# EAGLE design picostepseq_mk2_16 (EAGLE 9.6.2)
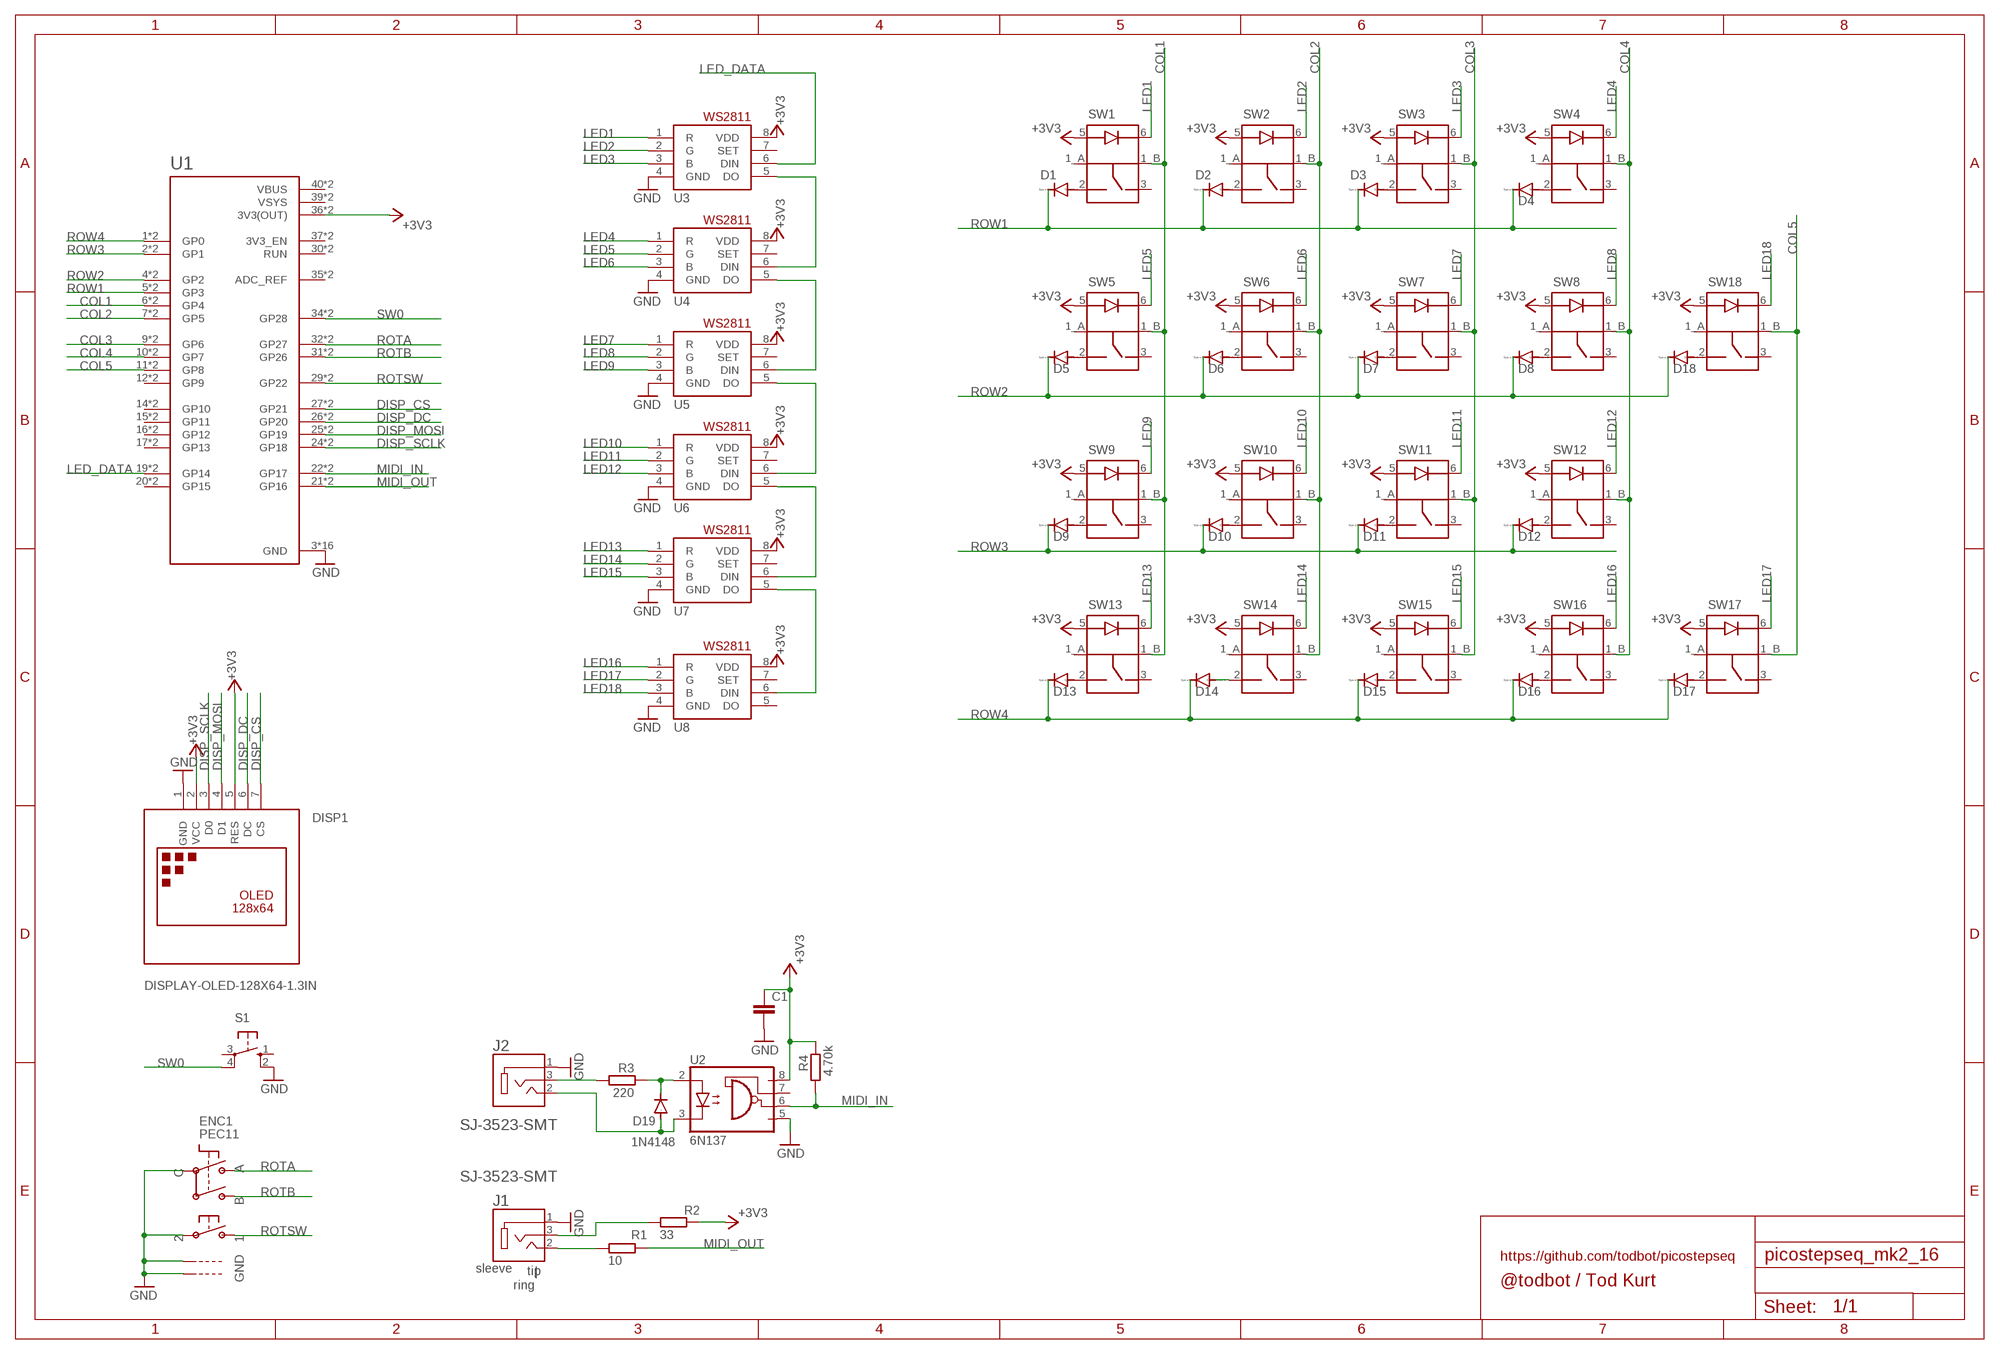
[diagram p0: schematic, sheet 1]

## Parts
C1  C-EU025-025X050  [C025-025X050]
D1  1N4148  1N4148DO35-7  [DO35-7]
D2  1N4148  1N4148DO35-7  [DO35-7]
D3  1N4148  1N4148DO35-7  [DO35-7]
D4  1N4148  1N4148DO35-7  [DO35-7]
D5  1N4148  1N4148DO35-7  [DO35-7]
D6  1N4148  1N4148DO35-7  [DO35-7]
D7  1N4148  1N4148DO35-7  [DO35-7]
D8  1N4148  1N4148DO35-7  [DO35-7]
D9  1N4148  1N4148DO35-7  [DO35-7]
D10  1N4148  1N4148DO35-7  [DO35-7]
D11  1N4148  1N4148DO35-7  [DO35-7]
D12  1N4148  1N4148DO35-7  [DO35-7]
D13  1N4148  1N4148DO35-7  [DO35-7]
D14  1N4148  1N4148DO35-7  [DO35-7]
D15  1N4148  1N4148DO35-7  [DO35-7]
D16  1N4148  1N4148DO35-7  [DO35-7]
D17  1N4148  1N4148DO35-7  [DO35-7]
D18  1N4148  1N4148DO35-7  [DO35-7]
D19  1N4148  1N4148DO35-7  [DO35-7]
DISP1  DISPLAY-OLED-128X64-1.3IN  [DISPLAY-OLED-128X64-1.3IN]
ENC1  PEC11  ENCODER_PLUS_SWITCH_BOURNS_PEC11  [PEC11+SWITCH]
J1  SJ-3523-SMT  [CUI_SJ-3523-SMT]
J2  SJ-3523-SMT  [CUI_SJ-3523-SMT]
R1  10  R-EU_0204/7  [0204/7]
R2  33  R-EU_0204/7  [0204/7]
R3  220  R-EU_0204/7  [0204/7]
R4  4.70k  R-EU_0204/7  [0204/7]
S1  10-XX  [B3F-10XX]
SW1  LED_SWITCHSTEP  [LED_SWITCH_STEP]
SW2  LED_SWITCHSTEP  [LED_SWITCH_STEP]
SW3  LED_SWITCHSTEP  [LED_SWITCH_STEP]
SW4  LED_SWITCHSTEP  [LED_SWITCH_STEP]
SW5  LED_SWITCHSTEP  [LED_SWITCH_STEP]
SW6  LED_SWITCHSTEP  [LED_SWITCH_STEP]
SW7  LED_SWITCHSTEP  [LED_SWITCH_STEP]
SW8  LED_SWITCHSTEP  [LED_SWITCH_STEP]
SW9  LED_SWITCHSTEP  [LED_SWITCH_STEP]
SW10  LED_SWITCHSTEP  [LED_SWITCH_STEP]
SW11  LED_SWITCHSTEP  [LED_SWITCH_STEP]
SW12  LED_SWITCHSTEP  [LED_SWITCH_STEP]
SW13  LED_SWITCHSTEP  [LED_SWITCH_STEP]
SW14  LED_SWITCHSTEP  [LED_SWITCH_STEP]
SW15  LED_SWITCHSTEP  [LED_SWITCH_STEP]
SW16  LED_SWITCHSTEP  [LED_SWITCH_STEP]
SW17  LED_SWITCHSTEP  [LED_SWITCH_STEP]
SW18  LED_SWITCHSTEP  [LED_SWITCH_STEP]
U1  RASPBERRY_PICO-NO_DEBUG  [PICO-PKG-NO_DEBUG]
U2  6N137  [DIL08]
U3  WS2811-SOP8  [SO08-SKINNYPADS]
U4  WS2811-SOP8  [SO08-SKINNYPADS]
U5  WS2811-SOP8  [SO08-SKINNYPADS]
U6  WS2811-SOP8  [SO08-SKINNYPADS]
U7  WS2811-SOP8  [SO08-SKINNYPADS]
U8  WS2811-SOP8  [SO08-SKINNYPADS]

## Nets
+3V3: C1.1 DISP1.2(VCC) DISP1.5(RES) R2.2 R4.1 SW1.5 SW2.5 SW3.5 SW4.5 SW5.5 SW6.5 SW7.5 SW8.5 SW9.5 SW10.5 SW11.5 SW12.5 SW13.5 SW14.5 SW15.5 SW16.5 SW17.5 SW18.5 U1.36(3V3(OUT)) U1.P$36(3V3(OUT)) U2.8(VCC) U3.8(VDD) U4.8(VDD) U5.8(VDD) U6.8(VDD) U7.8(VDD) U8.8(VDD)
COL1: SW1.1_B SW5.1_B SW9.1_B SW13.1_B U1.6(GP4) U1.P$6(GP4)
COL2: SW2.1_B SW6.1_B SW10.1_B SW14.1_B U1.7(GP5) U1.P$7(GP5)
COL3: SW3.1_B SW7.1_B SW11.1_B SW15.1_B U1.9(GP6) U1.P$9(GP6)
COL4: SW4.1_B SW8.1_B SW12.1_B SW16.1_B U1.10(GP7) U1.P$10(GP7)
COL5: SW17.1_B SW18.1_B U1.11(GP8) U1.P$11(GP8)
DISP_CS: DISP1.7(CS) U1.27(GP21) U1.P$27(GP21)
DISP_DC: DISP1.6(DC) U1.26(GP20) U1.P$26(GP20)
DISP_MOSI: DISP1.4(D1) U1.25(GP19) U1.P$25(GP19)
DISP_SCLK: DISP1.3(D0) U1.24(GP18) U1.P$24(GP18)
GND: C1.2 DISP1.1(GND) ENC1.P$2 ENC1.P$C ENC1.P$GND1 ENC1.P$GND2 J1.1 J2.1 S1.2(S1) U1.3(GND) U1.8(GND) U1.13(GND) U1.18(GND) U1.23(GND) U1.28(GND) U1.33(GND) U1.38(GND) U1.P$3(GND) U1.P$8(GND) U1.P$13(GND) U1.P$18(GND) U1.P$23(GND) U1.P$28(GND) U1.P$33(GND) U1.P$38(GND) U2.5(GND) U3.4(GND) U4.4(GND) U5.4(GND) U6.4(GND) U7.4(GND) U8.4(GND)
LED1: SW1.6 U3.1(R)
LED2: SW2.6 U3.2(G)
LED3: SW3.6 U3.3(B)
LED4: SW4.6 U4.1(R)
LED5: SW5.6 U4.2(G)
LED6: SW6.6 U4.3(B)
LED7: SW7.6 U5.1(R)
LED8: SW8.6 U5.2(G)
LED9: SW9.6 U5.3(B)
LED10: SW10.6 U6.1(R)
LED11: SW11.6 U6.2(G)
LED12: SW12.6 U6.3(B)
LED13: SW13.6 U7.1(R)
LED14: SW14.6 U7.2(G)
LED15: SW15.6 U7.3(B)
LED16: SW16.6 U8.1(R)
LED17: SW17.6 U8.2(G)
LED18: SW18.6 U8.3(B)
LED_DATA: U1.19(GP14) U1.P$19(GP14) U3.6(DIN)
MIDI_IN: R4.2 U1.22(GP17) U1.P$22(GP17) U2.6(VO)
MIDI_OUT: R1.2 U1.21(GP16) U1.P$21(GP16)
N$1: J1.2 R1.1
N$2: D19.C R3.1 U2.2(A)
N$3: D1.A SW1.2
N$4: D19.A J2.2 U2.3(C)
N$5: D2.A SW2.2
N$6: D3.A SW3.2
N$7: D4.A SW4.2
N$8: D5.A SW5.2
N$9: D9.A SW9.2
N$10: D10.A SW10.2
N$11: D11.A SW11.2
N$12: D12.A SW12.2
N$13: J1.3 R2.1
N$14: J2.3 R3.2
N$15: D13.A SW13.2
N$16: D14.A SW14.2
N$17: D15.A SW15.2
N$18: D16.A SW16.2
N$19: D17.A SW17.2
N$20: D6.A SW6.2
N$21: D18.A SW18.2
N$22: U3.5(DO) U4.6(DIN)
N$23: U4.5(DO) U5.6(DIN)
N$25: U5.5(DO) U6.6(DIN)
N$26: U6.5(DO) U7.6(DIN)
N$27: U7.5(DO) U8.6(DIN)
N$29: D7.A SW7.2
N$30: D8.A SW8.2
ROTA: ENC1.P$A U1.32(GP27) U1.P$32(GP27)
ROTB: ENC1.P$B U1.31(GP26) U1.P$31(GP26)
ROTSW: ENC1.P$1 U1.29(GP22) U1.P$29(GP22)
ROW1: D1.C D2.C D3.C D4.C U1.5(GP3) U1.P$5(GP3)
ROW2: D5.C D6.C D7.C D8.C D18.C U1.4(GP2) U1.P$4(GP2)
ROW3: D9.C D10.C D11.C D12.C U1.2(GP1) U1.P$2(GP1)
ROW4: D13.C D14.C D15.C D16.C D17.C U1.1(GP0) U1.P$1(GP0)
SW0: S1.4(P1) U1.34(GP28) U1.P$34(GP28)
Unconnected: S1.1(S) S1.3(P) SW1.1_A SW1.3 SW2.1_A SW2.3 SW3.1_A SW3.3 SW4.1_A SW4.3 SW5.1_A SW5.3 SW6.1_A SW6.3 SW7.1_A SW7.3 SW8.1_A SW8.3 SW9.1_A SW9.3 SW10.1_A SW10.3 SW11.1_A SW11.3 SW12.1_A SW12.3 SW13.1_A SW13.3 SW14.1_A SW14.3 SW15.1_A SW15.3 SW16.1_A SW16.3 SW17.1_A SW17.3 SW18.1_A SW18.3 U1.12(GP9) U1.14(GP10) U1.15(GP11) U1.16(GP12) U1.17(GP13) U1.20(GP15) U1.30(RUN) U1.35(ADC_REF) U1.37(3V3_EN) U1.P$12(GP9) U1.P$14(GP10) U1.P$15(GP11) U1.P$16(GP12) U1.P$17(GP13) U1.P$20(GP15) U1.P$30(RUN) U1.P$35(ADC_REF) U1.P$37(3V3_EN) U2.7(VE) U3.7(SET) U4.7(SET) U5.7(SET) U6.7(SET) U7.7(SET) U8.5(DO) U8.7(SET)

## Notes on the sheet
- https://github.com/todbot/picostepseq
- sleeve | tip
- @todbot / Tod Kurt
- |
  ring

## Power pins joined to a net without a drawn wire
VBUS: U1.40(VBUS) U1.P$40(VBUS)
VSYS: U1.39(VSYS) U1.P$39(VSYS)

## Library data of the parts
C1 = rcl:C-EU: CAPACITOR, European symbol; SPICEPREFIX: C
D1-D19 = diode:1N4148: DIODE high speed (Philips)
DISP1 = todstuff:DISPLAY-OLED-128X64: 128x64 Dot Matrix OLED Module based on SSD1306 chip Variant with SPI interface More details available here: http://www.instructables.com/id/How-to-use-OLED-display-arduino-module/ SSD1306 datasheet: https://cdn-shop.adafruit.com/datasheets/SSD1306.pdf Click here to find device on ebay.com <http://www.ebay.com/sch/oled+display+128x64> Note: There are two variants: I2C and SPI. Search for the proper version.
ENC1 = adafruit_electromech:ENCODER_PLUS_SWITCH: Rotary Encoder with Built-In Switch PEC11 - 24 Step, PEC11-4215F-S24 - http://www.adafruit.com/products/377
J1 J2 = SJ-3523-SMT:SJ-3523-SMT: Audio Jack Connector 3.5 mm Low Profile Surface Mount Stereo Jack, 3 Pin Right-Angle; CUI_PURCHASE_URL: https://www.cuidevices.com/product/interconnect/connectors/audio-connectors/jacks/sj-352x-smt-series?utm_source=snapeda.com&utm_medium=referral&utm_campaign=snapedaBOM; DESCRIPTION: 3.5 mm, Stereo, Right Angle, Surface Mount (SMT), 3 Conductors, 0~1 Internal Switches, Audio Jack Connector; DIGI-KEY_PART_NUMBER: CP-3523SJCT-ND; MF: CUI Devices; MP: SJ-3523-SMT-TR; PACKAGE: None; PURCHASE-URL: https://pricing.snapeda.com/search/part/SJ-3523-SMT-TR/?ref=eda
R1-R4 = rcl:R-EU_: RESISTOR, European symbol; SPICEPREFIX: R
S1 = switch-omron:10-XX: OMRON SWITCH; MPN: B3F-1000; OC_FARNELL: 176432; OC_NEWARK: 36M3542
SW1-SW18 = todstuff:LED_SWITCH: Step switch with LED, like on old drum machines https://www.adafruit.com/product/5519
U1 = RpiPico:RASPBERRY_PICO-NO_DEBUG
U2 = optocoupler:6N137: MOTOROLA OPTO COUPLER; MPN: 6N137; OC_FARNELL: 1328376; OC_NEWARK: 52M1895
U3-U8 = adafruit:WS2811

## Board
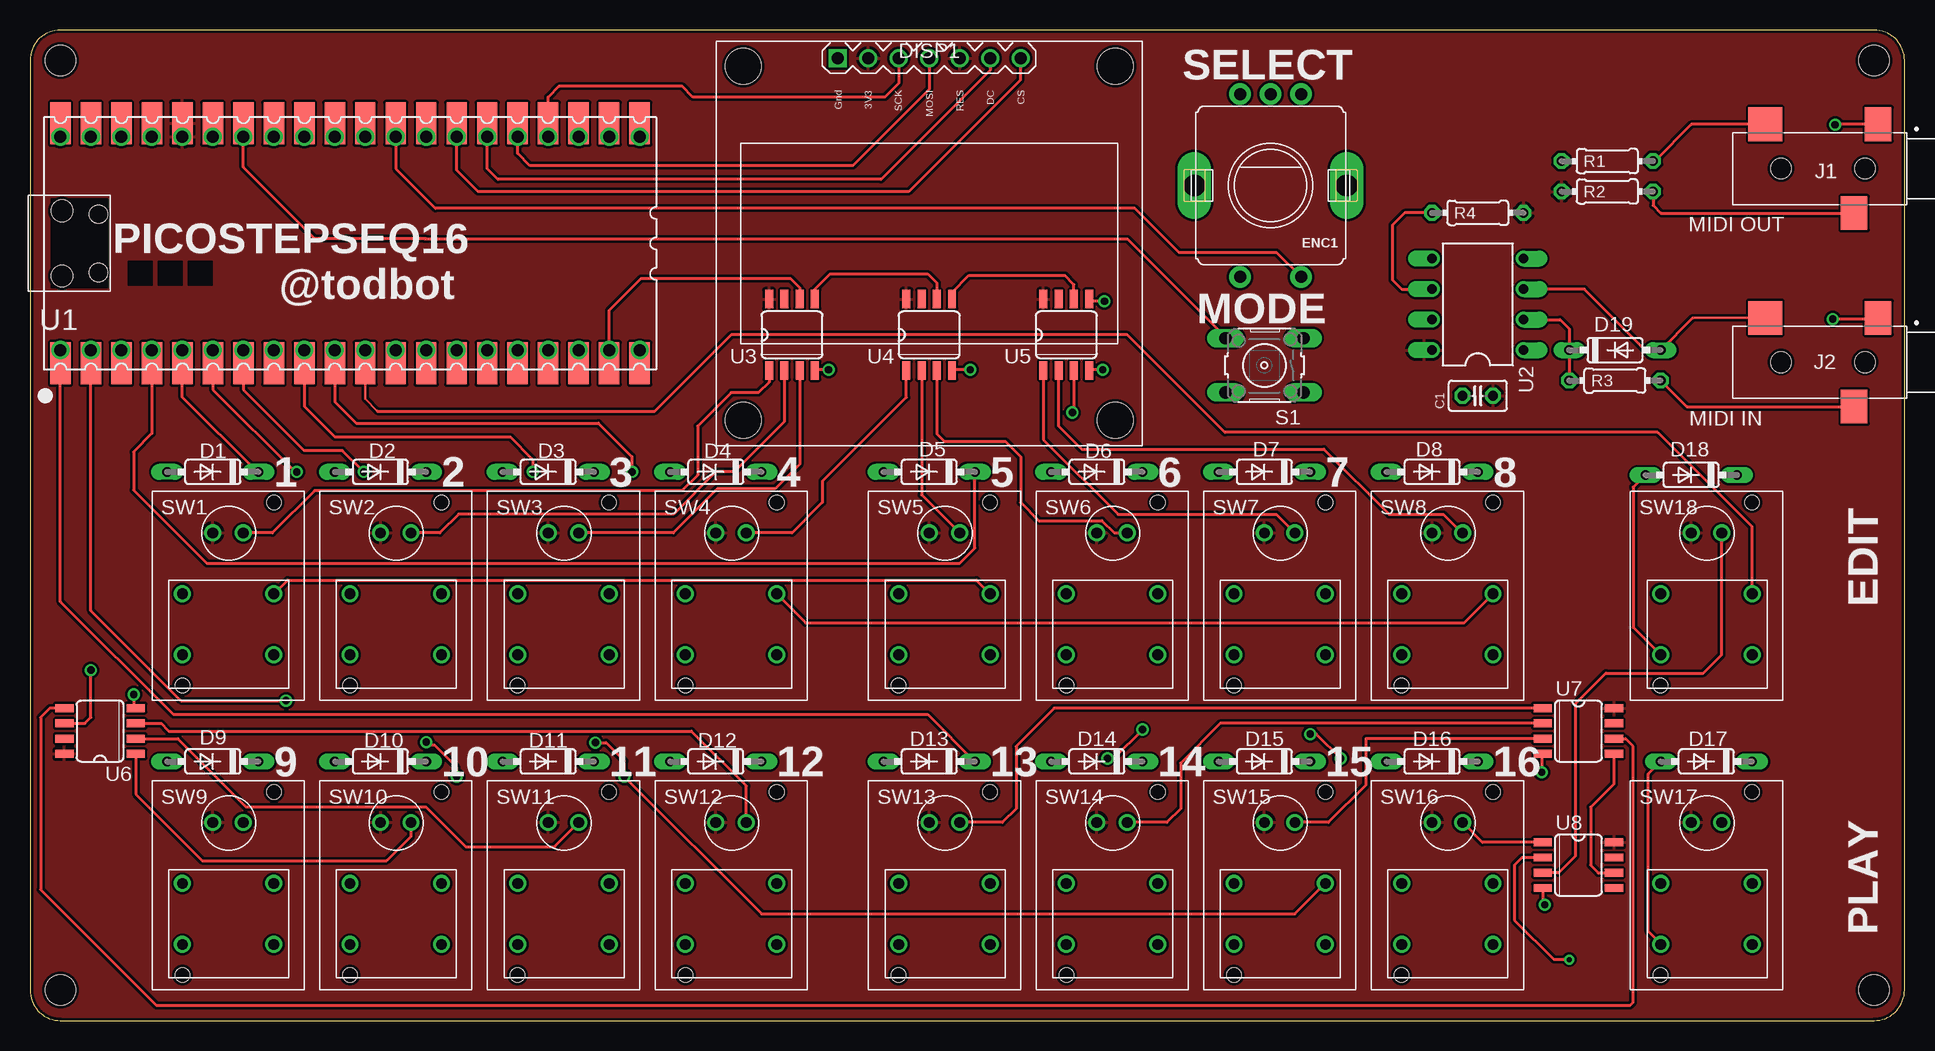
[diagram p1: board, top side]
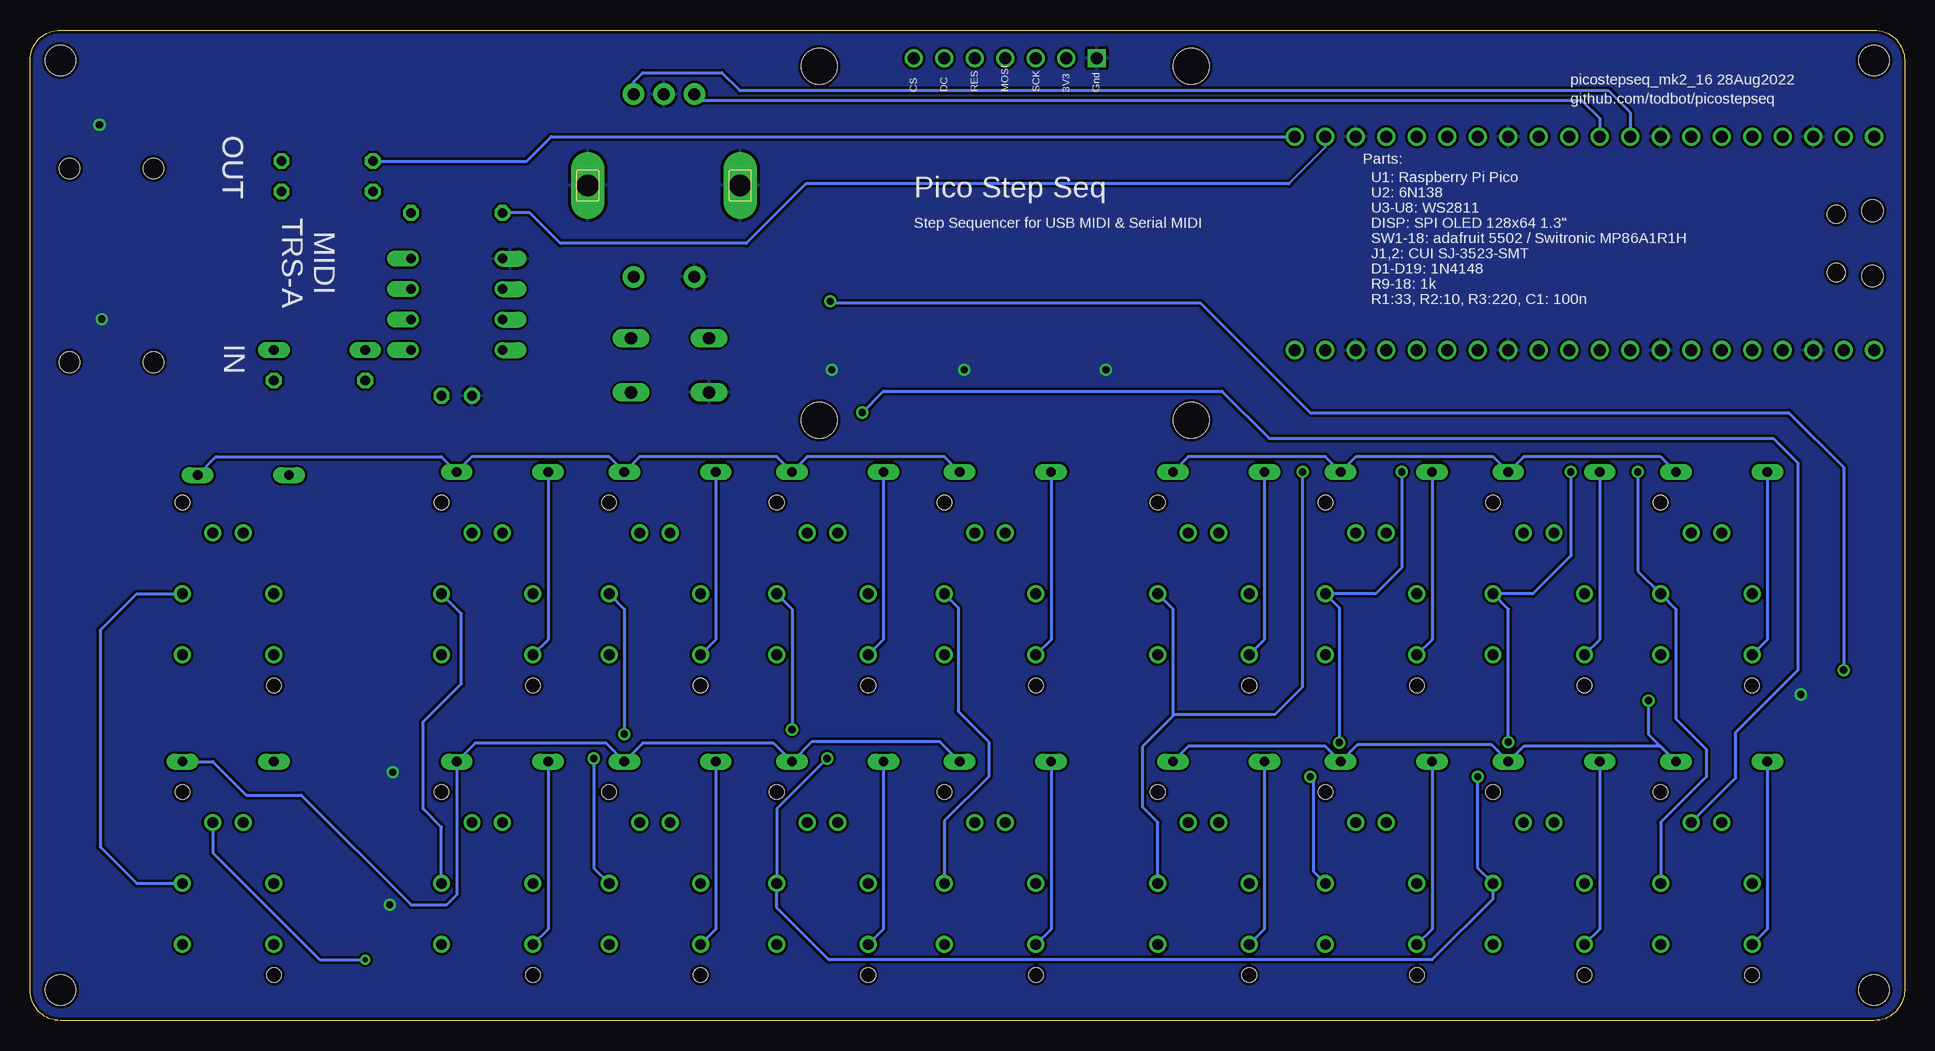
[diagram p2: board, bottom side, seen from below]

Size 156.21 x 82.55 mm. Coordinates in mm from the lower left corner, seen from the top.
Outline: 0,80.01 0,2.54 arc90 2.54,0 153.67,0 arc90 156.21,2.54 156.21,80.01 arc90 153.67,82.55 2.54,82.55 arc90 0,80.01
Copper layers (1*16): Top 0.035mm / dielectric 1.5mm / Bottom 0.035mm
Design rules "adafruit-rules-20180530": minimum track width 8mil, minimum drill 16mil, track to track 8mil, track to pad 8mil, pad to pad 8mil, via to via 8mil, smd to smd 8mil, copper to edge 10mil, drill to drill 8mil, minimum pad ring 10mil, minimum via ring 8mil, stop-mask expansion 4mil, vias tented up to drill 20mil, thermal gap 10mil
Holes 2.54 mm at 2.54,2.54 153.67,2.54 153.67,80.01 2.54,80.01

### Footprints (pad centres in the part's own frame; a part is rotated, then mirrored left to right if it is on the bottom)
C025-025X050 = drill 0.813 octagon: 1 -1.27,0; 2 1.27,0
DO35-7 = drill 0.813 long: A 3.81,0; C -3.81,0
DISPLAY-OLED-128X64-1.3IN = drill 1 square: 1 -7.62,15.43 | drill 1: 2 -5.08,15.43; 3 -2.54,15.43; 4 0,15.43; 5 2.54,15.43; 6 5.08,15.43; 7 7.62,15.43 | hole 3: -15.5,14.75; 15.5,14.75; 15.5,-14.75; -15.5,-14.75
PEC11+SWITCH = drill 1 pad 1.8: P$1 -2.54,7.62; P$2 2.54,7.62; P$A -2.54,-7.62; P$B 2.54,-7.62; P$C 0,-7.62 | drill 1.8 pad 2.8 long: P$GND1 -6.35,0; P$GND2 6.35,0
CUI_SJ-3523-SMT = smd 2.2 x 2.8: 1 -1.1,-3.7; 3 0.9,3.7 | smd 2.8 x 2.8: 2 8.3,-3.7 | hole 1.7: 0,0; 7,0
0204/7 = drill 0.813 octagon: 1 -3.81,0; 2 3.81,0
B3F-10XX = drill 1.016 long: 1 -3.251,2.261; 2 3.251,2.261; 3 -3.251,-2.261; 4 3.251,-2.261
LED_SWITCH_STEP = drill 0.9: 1_A -3.81,0; 1_B 3.81,0; 2 -3.81,-5.08; 3 3.81,-5.08; 5 -1.27,5.08; 6 1.27,5.08 | hole 1.2: -3.81,-7.62; 3.81,7.62
PICO-PKG-NO_DEBUG = drill 1: 1 -7.62,25.4; 2 -7.62,22.86; 3 -7.62,20.32; 4 -7.62,17.78; 5 -7.62,15.24; 6 -7.62,12.7; 7 -7.62,10.16; 8 -7.62,7.62; 9 -7.62,5.08; 10 -7.62,2.54; 11 -7.62,0; 12 -7.62,-2.54; 13 -7.62,-5.08; 14 -7.62,-7.62; 15 -7.62,-10.16; 16 -7.62,-12.7; 17 -7.62,-15.24; 18 -7.62,-17.78; 19 -7.62,-20.32; 20 -7.62,-22.86; 21 10.16,-22.86; 22 10.16,-20.32; 23 10.16,-17.78; 24 10.16,-15.24; 25 10.16,-12.7; 26 10.16,-10.16; 27 10.16,-7.62; 28 10.16,-5.08; 29 10.16,-2.54; 30 10.16,0; 31 10.16,2.54; 32 10.16,5.08; 33 10.16,7.62; 34 10.16,10.16; 35 10.16,12.7; 36 10.16,15.24; 37 10.16,17.78; 38 10.16,20.32; 39 10.16,22.86; 40 10.16,25.4 | smd 3.5 x 1.7: P$1 -8.73,25.4; P$2 -8.73,22.86; P$3 -8.73,20.32; P$4 -8.73,17.78; P$5 -8.73,15.24; P$6 -8.73,12.7; P$7 -8.73,10.16; P$8 -8.73,7.62; P$9 -8.73,5.08; P$10 -8.73,2.54; P$11 -8.73,0; P$12 -8.73,-2.54; P$13 -8.73,-5.08; P$14 -8.73,-7.62; P$15 -8.73,-10.16; P$16 -8.73,-12.7; P$17 -8.73,-15.24; P$18 -8.73,-17.78; P$19 -8.73,-20.32; P$20 -8.73,-22.86; P$21 11.27,-22.86; P$22 11.27,-20.32; P$23 11.27,-17.78; P$24 11.27,-15.24; P$25 11.27,-12.7; P$26 11.27,-10.16; P$27 11.27,-7.62; P$28 11.27,-5.08; P$29 11.27,-2.54; P$30 11.27,0; P$31 11.27,2.54; P$32 11.27,5.08; P$33 11.27,7.62; P$34 11.27,10.16; P$35 11.27,12.7; P$36 11.27,15.24; P$37 11.27,17.78; P$38 11.27,20.32; P$39 11.27,22.86; P$40 11.27,25.4 | hole 1.8: -1.455,25.27; 3.995,25.27 | hole 1.5: -1.155,22.24; 3.695,22.24
DIL08 = drill 0.813 offset: 1 -3.81,-3.81; 2 -1.27,-3.81; 3 1.27,-3.81; 4 3.81,-3.81; 5 3.81,3.81; 6 1.27,3.81; 7 -1.27,3.81; 8 -3.81,3.81
SO08-SKINNYPADS = smd 0.66 x 1.524: 1 -1.905,-2.973; 2 -0.635,-2.973; 3 0.635,-2.973; 4 1.905,-2.973; 5 1.905,2.973; 6 0.635,2.973; 7 -0.635,2.973; 8 -1.905,2.973

### Placement (x,y rotation side)
C1  120.65,52.07 180 top
D1  15.24,45.72 180 top
D2  29.21,45.72 180 top
D3  43.18,45.72 180 top
D4  57.15,45.72 180 top
D5  74.93,45.72 180 top
D6  88.9,45.72 180 top
D7  102.87,45.72 180 top
D8  116.84,45.72 180 top
D9  15.24,21.59 180 top
D10  29.21,21.59 180 top
D11  43.18,21.59 180 top
D12  57.15,21.59 180 top
D13  74.93,21.59 180 top
D14  88.9,21.59 180 top
D15  102.87,21.59 180 top
D16  116.84,21.59 180 top
D17  139.7,21.59 180 top
D18  138.43,45.47 180 top
D19  132.08,55.88 0 top
DISP1  74.93,64.77 0 top
ENC1  103.38,69.6 180 top
J1  152.91,70.99 180 top
J2  152.91,54.86 180 top
R1  131.44,71.63 180 top
R2  131.44,69.09 180 top
R3  132.08,53.34 0 top
R4  120.65,67.31 180 top
S1  102.87,54.61 180 top
SW1  16.51,35.56 0 top
SW2  30.48,35.56 0 top
SW3  44.45,35.56 0 top
SW4  58.42,35.56 0 top
SW5  76.2,35.56 0 top
SW6  90.17,35.56 0 top
SW7  104.14,35.56 0 top
SW8  118.11,35.56 0 top
SW9  16.51,11.43 0 top
SW10  30.48,11.43 0 top
SW11  44.45,11.43 0 top
SW12  58.42,11.43 0 top
SW13  76.2,11.43 0 top
SW14  90.17,11.43 0 top
SW15  104.14,11.43 0 top
SW16  118.11,11.43 0 top
SW17  139.7,11.43 0 top
SW18  139.7,35.56 0 top
U1  27.94,63.5 90 top
U2  120.65,59.69 90 top
U3  63.5,57.15 0 top
U4  74.93,57.15 0 top
U5  86.36,57.15 0 top
U6  5.84,24.13 90 top
U7  129.03,24.13 270 top
U8  129.03,12.95 270 top

### Tracks (layer width: path | path; a pad name or v marks a point on that pad's centre or on a via)
+3V3
  pour Top: 156.47,82.63 156.47,0.25 -0.4,0.25 -0.4,82.63
COL1  (via drill 0.6)
  Top 0.254: SW1.1_B 21.46,36.7 78.87,36.7 SW5.1_B | U1.6 U1.P$6 15.24,52.58 22.1,45.72 v22.23,45.72
  Bottom 0.254: SW9.1_B 20.32,16.51 16.51,20.32 16.51,22.61 19.05,25.15 19.05,34.29 SW1.1_B 22.23,37.47 v22.23,45.72 | SW5.1_B 78.87,34.42 78.87,25.78 76.33,23.24 76.33,20.32 80.01,16.64 SW13.1_B
COL2  (via drill 0.6)
  Top 0.254: v35.56,20.32 35.56,21.11 33.71,22.96 33.27,22.96 v33.02,23.21 | v92.71,24.26 90.3,21.84 v89.79,21.84 | U1.7 U1.P$7 17.78,52.58 22.86,47.5 26.04,47.5 v27.81,45.72
  Bottom 0.254: v35.56,20.32 35.56,12.7 SW10.1_B 34.29,10.16 39.39,5.06 89.64,5.06 93.98,9.4 SW14.1_B 93.98,17.65 v89.79,21.84 | v33.02,23.21 33.02,34.29 SW2.1_B 30.99,35.56 27.81,38.73 v27.81,45.72 | SW6.1_B 92.71,34.29 v92.71,24.26
COL3  (via drill 0.6)
  Top 0.254: v47.12,23.17 48.01,23.17 49.53,21.65 v49.53,20.32 60.96,8.89 105.41,8.89 SW15.1_B | v106.68,23.88 107.19,23.88 v109.22,21.84 | U1.9 U1.P$9 22.86,51.18 25.4,48.64 40.01,48.64 41.91,46.74 v41.91,45.72
  Bottom 0.254: v49.53,20.32 49.24,20.03 49.24,12.41 SW11.1_B | v47.12,23.17 47.12,34.42 SW3.1_B 44.07,35.56 41.91,37.72 v41.91,45.72 | SW7.1_B 106.68,34.29 v106.68,23.88 | v109.22,21.84 109.22,12.7 SW15.1_B
COL4  (via drill 0.6)
  Top 0.254: SW4.1_B 64.64,33.15 119.51,33.15 SW8.1_B | U1.10 U1.P$10 25.4,51.56 27.18,49.78 47.37,49.78 50.16,46.99 v50.16,45.72
  Bottom 0.254: SW12.1_B 62.23,16.51 63.5,17.78 63.5,22.86 60.96,25.4 | SW4.1_B 60.96,34.29 60.96,25.4 | SW16.1_B 121.92,16.13 123.44,17.65 123.44,24.89 120.27,28.07 120.27,33.91 SW8.1_B | 60.96,25.4 60.83,25.53 52.45,25.53 50.16,27.81 v50.16,45.72
COL5
  Top 0.203: 28.96,50.8 27.94,51.82 U1.P$11
  Top 0.254: U1.P$11 U1.11 | SW18.1_B 143.51,41.15 135.64,49.02 99.57,49.02 91.44,57.15 58.42,57.15 52.07,50.8 28.96,50.8
  Bottom 0.254: SW18.1_B 147.32,35.56 150.37,32.51 150.37,14.48 147.32,11.43 SW17.1_B
DISP_CS
  Top 0.254: DISP1.7 82.55,78.42 73.22,69.09 37.34,69.09 35.56,70.87 U1.27 U1.P$27
DISP_DC
  Top 0.203: U1.P$26 U1.26
  Top 0.254: DISP1.6 80.01,79.18 70.93,70.1 38.99,70.1 38.1,70.99 U1.P$26
DISP_MOSI
  Top 0.254: DISP1.4 74.93,77.6 68.58,71.25 41.66,71.25 40.64,72.26 U1.25 U1.P$25
DISP_SCLK
  Top 0.203: U1.P$24 U1.24
  Top 0.254: DISP1.3 72.39,78.11 71.25,76.96 55.24,76.96 54.36,77.85 44.07,77.85 43.18,76.96 U1.P$24
GND  (via drill 0.6)
  Top 0.203: U1.P$23 U1.23 | J2.1 153.9,58.46 | 150.45,74.69 v150.42,74.66
  Top 0.254: U1.P$3 U1.3 | U1.P$8 U1.8 | U1.P$13 U1.13 | U1.P$18 U1.18 | U1.P$33 U1.33 | U1.P$38 U1.38 | 153.9,58.46 v150.22,58.46 | J1.1 150.45,74.69 | U1.P$28 U1.28 | U3.4 65.46,54.23 v66.55,54.23 | U4.4 76.89,54.23 v78.36,54.23 | U5.4 88.32,54.23 v89.41,54.23 | U6.4 8.64,26.21 v8.64,27.18 | U7.4 125.98,22.15 v125.98,20.7 | U8.4 126.06,9.83 v126.24,9.65
  pour Bottom: 0,82.36 158.75,82.36 158.75,0.25 0,0.25
LED1
  Top 0.254: SW1.6 20.19,40.64 23.71,44.16 54.32,44.16 55.63,45.47 55.63,49.53 58.42,52.32 60.71,52.32 61.59,53.21 U3.1
LED2
  Top 0.254: SW2.6 34.16,40.64 35.72,42.2 53.63,42.2 57.15,45.72 58.67,45.72 62.87,49.91 U3.2
LED3
  Top 0.254: SW3.6 53.61,40.64 57.29,44.32 62.1,44.32 64.14,46.35 U3.3
LED4
  Top 0.254: SW4.6 63.5,40.64 66.04,43.18 66.04,44.96 73.03,51.94 U4.1
LED5
  Top 0.254: U4.2 74.3,43.81 SW5.6
LED6
  Top 0.254: U4.3 75.56,48.9 76.2,48.26 81.28,48.26 82.55,46.99 82.55,43.18 84.06,41.67 89.33,41.67 90.36,40.64 SW6.6
LED7
  Top 0.254: U5.1 84.45,48.42 90.68,42.19 103.86,42.19 SW7.6
LED8
  Top 0.254: SW8.6 119.32,40.64 117.78,42.18 113.27,42.18 107.82,47.63 87.63,47.63 85.72,49.54 U5.2
LED9  (via drill 0.6)
  Top 0.254: U5.3 87,50.8 v86.87,50.67
  Bottom 0.254: v86.87,50.67 85.09,52.45 56.9,52.45 52.96,48.51 10.92,48.51 8.89,46.48 8.89,29.21 14.1,24 14.1,20.19 SW9.6
LED10
  Top 0.254: U6.1 8.81,18.87 14.35,13.34 29.72,13.34 31.75,15.37 SW10.6
LED11
  Top 0.254: SW11.6 43.69,14.48 36.32,14.48 33.02,17.78 18.03,17.78 12.32,23.5 U6.2
LED12
  Top 0.254: U6.3 10.92,24.77 11.56,24.13 55.12,24.13 59.69,19.56 SW12.6
LED13
  Top 0.254: SW13.6 81.03,16.51 82.17,17.65 82.17,22.86 85.34,26.04 U7.1
LED14
  Top 0.254: U7.2 99.19,24.77 95.89,21.46 95.89,17.65 94.74,16.51 SW14.6
LED15
  Top 0.254: U7.3 111.33,23.5 111.33,19.63 108.2,16.51 SW15.6
LED16
  Top 0.254: U8.1 121.03,14.86 SW16.6
LED17  (via drill 0.41)
  Top 0.254: U8.2 124.33,13.59 123.7,12.95 123.7,8.38 127,5.08 v128.27,5.08
  Bottom 0.254: SW17.6 140.97,13.97 132.08,5.08 v128.27,5.08
LED18
  Top 0.254: U8.3 127.38,12.32 128.78,13.72 128.78,26.42 131.32,28.96 139.45,28.96 140.97,30.48 SW18.6
LED_DATA
  Top 0.254: U1.19 U1.P$19 48.26,59.18 50.93,61.85 63.37,61.85 64.14,61.09 U3.6
MIDI_IN
  Top 0.203: U1.P$22 U1.22
  Top 0.254: R4.2 114.55,67.31 113.54,66.29 113.54,61.72 114.3,60.96 U2.6
  Bottom 0.203: 51.3,69.73 48.26,72.77 U1.22
  Bottom 0.254: R4.2 114.55,67.31 112.01,64.77 96.52,64.77 91.56,69.73 51.3,69.73
MIDI_OUT
  Top 0.203: U1.P$21 U1.21
  Bottom 0.254: U1.21 112.78,73.66 114.81,71.63 R1.2
N$1
  Top 0.254: J1.2 138.45,74.69 135.38,71.63 R1.1
N$2
  Top 0.254: R3.1 D19.C 128.27,57.66 127.51,58.42 U2.2
N$3
  Bottom 0.254: D1.A 11.43,31.75 SW1.2
N$4
  Top 0.203: 138.57,58.56 J2.2
  Top 0.254: 138.57,58.56 D19.A 134.62,55.88 129.54,60.96 U2.3
N$5
  Bottom 0.254: D2.A 25.4,31.75 SW2.2
N$6
  Bottom 0.254: D3.A 39.37,31.75 SW3.2
N$7
  Bottom 0.254: D4.A 53.34,31.75 SW4.2
N$8
  Bottom 0.254: D5.A 71.12,31.75 SW5.2
N$9
  Bottom 0.254: SW9.2 11.43,7.62 D9.A
N$10
  Bottom 0.254: SW10.2 25.4,7.62 D10.A
N$11
  Bottom 0.254: SW11.2 39.37,7.62 D11.A
N$12
  Bottom 0.254: SW12.2 53.34,7.62 D12.A
N$13
  Top 0.254: R2.1 135.25,67.94 135.91,67.29 J1.3
N$14
  Top 0.254: R3.2 138.07,51.16 J2.3
N$15
  Bottom 0.254: D13.A 71.12,7.62 SW13.2
N$16
  Bottom 0.254: D14.A 85.09,7.62 SW14.2
N$17
  Bottom 0.254: D15.A 99.06,7.62 SW15.2
N$18
  Bottom 0.254: D16.A 113.03,7.62 SW16.2
N$19
  Top 0.254: SW17.2 135.89,6.41 134.86,7.45 134.86,20.56 D17.A
N$20
  Bottom 0.254: D6.A 85.09,31.75 SW6.2
N$21
  Top 0.254: D18.A 133.6,44.45 133.6,32.77 SW18.2
N$22
  Top 0.254: U3.5 65.41,60.96 66.67,62.23 74.8,62.23 75.56,61.47 U4.6
N$23
  Top 0.254: U5.6 87,61.34 86.23,62.1 78.23,62.1 76.83,60.71 U4.5
N$25  (via drill 0.6)
  Top 0.254: U6.6 4.57,24.77 5.08,25.27 v5.08,29.21 | U5.5 88.27,59.94 v89.53,59.94
  Bottom 0.254: v89.53,59.94 89.53,59.82 58.67,59.82 49.53,50.67 9.65,50.67 5.08,46.1 v5.08,29.21
N$26
  Top 0.254: U6.5 1.65,26.04 0.89,25.27 0.89,10.92 10.54,1.27 133.35,1.27 133.6,1.52 133.6,22.86 132.97,23.5 U7.6
N$27
  Top 0.254: U8.6 130.68,12.32 130.05,12.95 130.05,17.78 132,19.74 U7.5
N$29
  Bottom 0.254: D7.A 99.06,31.75 SW7.2
N$30
  Bottom 0.254: D8.A 113.03,31.75 SW8.2
ROTA
  Top 0.254: U1.P$32 U1.32
  Bottom 0.254: U1.32 22.86,75.69 24.64,77.47 97.03,77.47 98.55,78.99 105.16,78.99 105.92,78.23 ENC1.P$A
ROTB
  Top 0.254: U1.P$31 U1.31
  Bottom 0.254: ENC1.P$B 100.33,76.71 26.92,76.71 25.4,75.18 U1.31
ROTSW
  Top 0.203: U1.P$29 U1.29
  Top 0.254: ENC1.P$1 103.89,64.01 95.76,64.01 92.08,67.69 33.78,67.69 30.48,70.99 U1.P$29
ROW1
  Top 0.254: D1.C 18.92,45.72 12.7,51.94 U1.P$5 U1.5
  Bottom 0.254: D1.C 20.32,46.99 31.75,46.99 D2.C 34.29,46.99 45.72,46.99 D3.C 48.26,46.99 59.69,46.99 D4.C
ROW2
  Top 0.254: D5.C 78.74,39.37 77.47,38.1 14.73,38.1 8.64,44.2 8.64,47.4 10.16,48.93 U1.P$4 U1.4
  Bottom 0.254: D5.C 80.01,46.99 91.44,46.99 D6.C 93.98,46.99 105.41,46.99 D7.C 107.95,46.99 119.38,46.99 D8.C 121.92,46.99 140.72,46.99 D18.C
ROW3  (via drill 0.6)
  Top 0.254: v21.34,26.67 12.57,26.67 5.08,34.16 U1.P$2 U1.2
  Bottom 0.254: D12.C 59.69,22.86 48.26,22.86 D11.C 45.59,22.99 34.42,22.99 D10.C 31.75,22.86 20.32,22.86 D9.C 21.34,23.88 v21.34,26.67
ROW4
  Top 0.254: D13.C 74.8,25.53 11.94,25.53 2.54,34.92 U1.1 U1.P$1
  Bottom 0.254: D13.C 80.39,23.24 91.06,23.24 D14.C 94.23,23.11 105.16,23.11 D15.C 108.2,23.11 119.13,23.11 D16.C 120.63,21.57 120.63,10.49 121.49,9.63 124.46,9.63 133.6,18.78 133.6,18.8 138.18,18.8 140.97,21.59 D17.C
SW0
  Top 0.203: U1.P$34 U1.34 | 99.62,56.97 S1.4
  Top 0.254: 32.89,65.15 33.02,65.15 | 33.02,65.15 91.44,65.15 99.62,56.97 | 33.02,65.15 23.75,65.15 17.78,71.12 U1.34
VBUS
  Top 0.254: U1.P$40 U1.40
VSYS
  Top 0.254: U1.P$39 U1.39

### Text on the board
tPlace: SELECT | Gnd | 3V3 | SCK | MOSI | RES | DC | CS | PICOSTEPSEQ16 | MIDI OUT | @todbot | MODE | MIDI IN | 1 | 2 | 3 | 4 | 5 | 6 | 7 | 8 | EDIT | 9 | 10 | 11 | 12 | 13 | 14 | 15 | 16 | PLAY
bPlace: picostepseq_mk2_16 28Aug2022 | Gnd | 3V3 | SCK | MOSI | RES | DC | CS | github.com/todbot/picostepseq | Parts: | OUT | U1: Raspberry Pi Pico | U2: 6N138 | Pico Step Seq | U3-U8: WS2811 | DISP: SPI OLED 128x64 1.3" | Step Sequencer for USB MIDI & Serial MIDI | SW1-18: adafruit 5502 / Switronic MP86A1R1H | J1,2: CUI SJ-3523-SMT | MIDI / TRS-A | D1-D19: 1N4148 | R9-18: 1k | R1:33, R2:10, R3:220, C1: 100n | IN